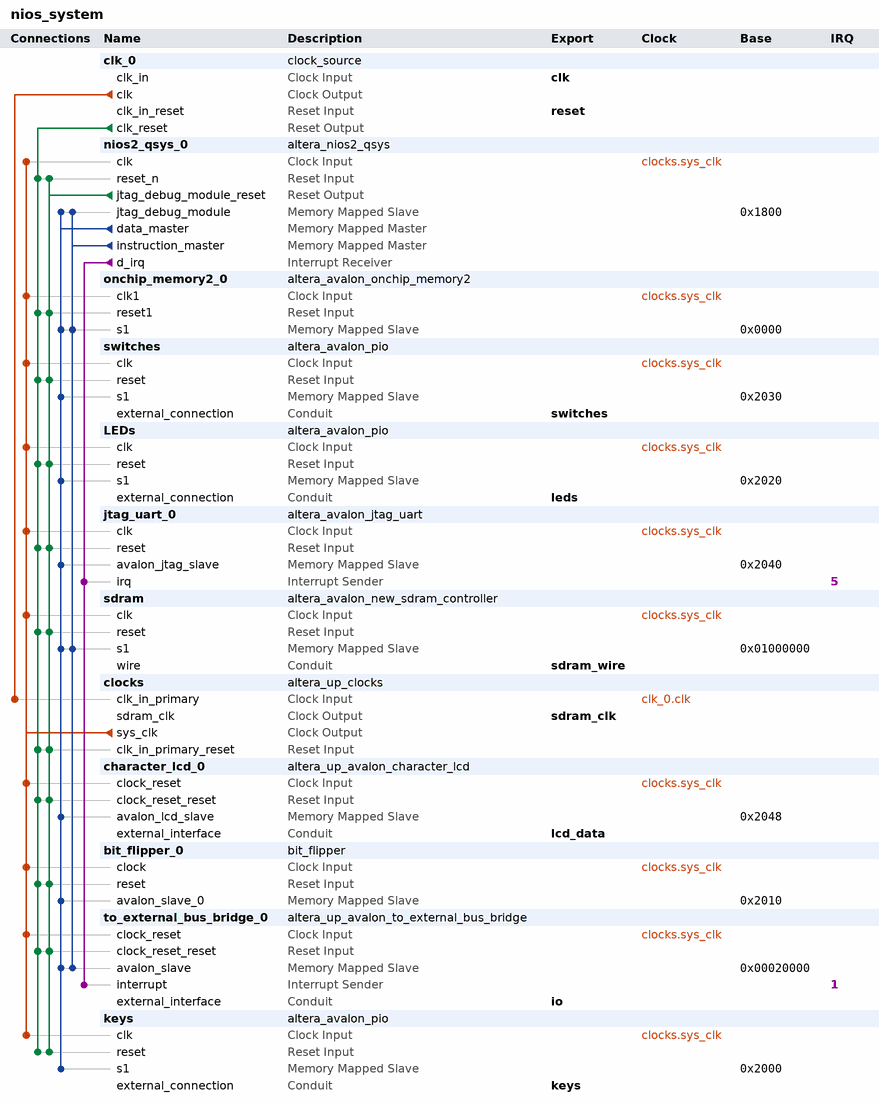
[diagram p0: system contents]
# Platform Designer (Qsys) system nios_system, Cyclone II EP2C35F672C6
# Parameters at their usual value, and those the tool derives, are not listed.
package require -exact qsys 13.0.1.99.2
create_system nios_system
set_project_property DEVICE_FAMILY {Cyclone II}
set_project_property DEVICE EP2C35F672C6

add_instance clk_0 clock_source 13.0
set_instance_parameter_value clk_0 clockFrequency 50000000

add_instance nios2_qsys_0 altera_nios2_qsys 13.0
set_instance_parameter_value nios2_qsys_0 resetSlave sdram.s1
set_instance_parameter_value nios2_qsys_0 mmu_TLBMissExcSlave None
set_instance_parameter_value nios2_qsys_0 exceptionSlave sdram.s1
set_instance_parameter_value nios2_qsys_0 breakSlave nios2_qsys_0.jtag_debug_module
set_instance_parameter_value nios2_qsys_0 impl Tiny
set_instance_parameter_value nios2_qsys_0 icache_size 4096

add_instance onchip_memory2_0 altera_avalon_onchip_memory2 13.0.1.99.2
set_instance_parameter_value onchip_memory2_0 dataWidth 32
set_instance_parameter_value onchip_memory2_0 dualPort false
set_instance_parameter_value onchip_memory2_0 initMemContent true
set_instance_parameter_value onchip_memory2_0 initializationFileName onchip_mem.hex
set_instance_parameter_value onchip_memory2_0 memorySize 4096

add_instance switches altera_avalon_pio 13.0.1.99.2
set_instance_parameter_value switches direction Input
set_instance_parameter_value switches width 8

add_instance LEDs altera_avalon_pio 13.0.1.99.2
set_instance_parameter_value LEDs direction Output
set_instance_parameter_value LEDs width 8

add_instance jtag_uart_0 altera_avalon_jtag_uart 13.0.1.99.2
set_instance_parameter_value jtag_uart_0 simInteractiveOptions NO_INTERACTIVE_WINDOWS

add_instance sdram altera_avalon_new_sdram_controller 13.0.1.99.2
set_instance_parameter_value sdram TAC 5.5
set_instance_parameter_value sdram TRCD 20.0
set_instance_parameter_value sdram TRP 20.0
set_instance_parameter_value sdram casLatency 3
set_instance_parameter_value sdram columnWidth 8
set_instance_parameter_value sdram dataWidth 16
set_instance_parameter_value sdram generateSimulationModel false
set_instance_parameter_value sdram model single_Micron_MT48LC4M32B2_7_chip
set_instance_parameter_value sdram numberOfBanks 4
set_instance_parameter_value sdram numberOfChipSelects 1
set_instance_parameter_value sdram powerUpDelay 100.0
set_instance_parameter_value sdram refreshPeriod 15.625
set_instance_parameter_value sdram rowWidth 12

add_instance clocks altera_up_clocks 13.0
set_instance_parameter_value clocks board DE2
set_instance_parameter_value clocks vga_clk false
set_instance_parameter_value clocks audio_clk false
set_instance_parameter_value clocks audio_clk_freq 12.288

add_instance character_lcd_0 altera_up_avalon_character_lcd 13.0
set_instance_parameter_value character_lcd_0 cursor Normal

add_instance bit_flipper_0 bit_flipper 1.0

add_instance to_external_bus_bridge_0 altera_up_avalon_to_external_bus_bridge 13.0
set_instance_parameter_value to_external_bus_bridge_0 addr_size 64
set_instance_parameter_value to_external_bus_bridge_0 addr_size_multiplier Kbytes
set_instance_parameter_value to_external_bus_bridge_0 data_size 16

add_instance keys altera_avalon_pio 13.0.1.99.2
set_instance_parameter_value keys direction Input
set_instance_parameter_value keys width 4

# connections
add_connection clk_0.clk clocks.clk_in_primary clock
add_connection clocks.sys_clk bit_flipper_0.clock clock
add_connection clocks.sys_clk character_lcd_0.clock_reset clock
add_connection clocks.sys_clk jtag_uart_0.clk clock
add_connection clocks.sys_clk keys.clk clock
add_connection clocks.sys_clk LEDs.clk clock
add_connection clocks.sys_clk nios2_qsys_0.clk clock
add_connection clocks.sys_clk onchip_memory2_0.clk1 clock
add_connection clocks.sys_clk sdram.clk clock
add_connection clocks.sys_clk switches.clk clock
add_connection clocks.sys_clk to_external_bus_bridge_0.clock_reset clock
add_connection clk_0.clk_reset bit_flipper_0.reset reset
add_connection clk_0.clk_reset character_lcd_0.clock_reset_reset reset
add_connection clk_0.clk_reset clocks.clk_in_primary_reset reset
add_connection clk_0.clk_reset jtag_uart_0.reset reset
add_connection clk_0.clk_reset keys.reset reset
add_connection clk_0.clk_reset LEDs.reset reset
add_connection clk_0.clk_reset nios2_qsys_0.reset_n reset
add_connection clk_0.clk_reset onchip_memory2_0.reset1 reset
add_connection clk_0.clk_reset sdram.reset reset
add_connection clk_0.clk_reset switches.reset reset
add_connection clk_0.clk_reset to_external_bus_bridge_0.clock_reset_reset reset
add_connection nios2_qsys_0.jtag_debug_module_reset bit_flipper_0.reset reset
add_connection nios2_qsys_0.jtag_debug_module_reset character_lcd_0.clock_reset_reset reset
add_connection nios2_qsys_0.jtag_debug_module_reset clocks.clk_in_primary_reset reset
add_connection nios2_qsys_0.jtag_debug_module_reset jtag_uart_0.reset reset
add_connection nios2_qsys_0.jtag_debug_module_reset keys.reset reset
add_connection nios2_qsys_0.jtag_debug_module_reset LEDs.reset reset
add_connection nios2_qsys_0.jtag_debug_module_reset nios2_qsys_0.reset_n reset
add_connection nios2_qsys_0.jtag_debug_module_reset onchip_memory2_0.reset1 reset
add_connection nios2_qsys_0.jtag_debug_module_reset sdram.reset reset
add_connection nios2_qsys_0.jtag_debug_module_reset switches.reset reset
add_connection nios2_qsys_0.jtag_debug_module_reset to_external_bus_bridge_0.clock_reset_reset reset
add_connection nios2_qsys_0.data_master bit_flipper_0.avalon_slave_0 avalon
set_connection_parameter_value nios2_qsys_0.data_master/bit_flipper_0.avalon_slave_0 baseAddress 0x2010
add_connection nios2_qsys_0.data_master character_lcd_0.avalon_lcd_slave avalon
set_connection_parameter_value nios2_qsys_0.data_master/character_lcd_0.avalon_lcd_slave baseAddress 0x2048
add_connection nios2_qsys_0.data_master jtag_uart_0.avalon_jtag_slave avalon
set_connection_parameter_value nios2_qsys_0.data_master/jtag_uart_0.avalon_jtag_slave baseAddress 0x2040
add_connection nios2_qsys_0.data_master keys.s1 avalon
set_connection_parameter_value nios2_qsys_0.data_master/keys.s1 baseAddress 0x2000
add_connection nios2_qsys_0.data_master LEDs.s1 avalon
set_connection_parameter_value nios2_qsys_0.data_master/LEDs.s1 baseAddress 0x2020
add_connection nios2_qsys_0.data_master nios2_qsys_0.jtag_debug_module avalon
set_connection_parameter_value nios2_qsys_0.data_master/nios2_qsys_0.jtag_debug_module baseAddress 0x1800
add_connection nios2_qsys_0.data_master onchip_memory2_0.s1 avalon
set_connection_parameter_value nios2_qsys_0.data_master/onchip_memory2_0.s1 baseAddress 0x0000
add_connection nios2_qsys_0.data_master sdram.s1 avalon
set_connection_parameter_value nios2_qsys_0.data_master/sdram.s1 baseAddress 0x01000000
add_connection nios2_qsys_0.data_master switches.s1 avalon
set_connection_parameter_value nios2_qsys_0.data_master/switches.s1 baseAddress 0x2030
add_connection nios2_qsys_0.data_master to_external_bus_bridge_0.avalon_slave avalon
set_connection_parameter_value nios2_qsys_0.data_master/to_external_bus_bridge_0.avalon_slave baseAddress 0x00020000
add_connection nios2_qsys_0.instruction_master nios2_qsys_0.jtag_debug_module avalon
set_connection_parameter_value nios2_qsys_0.instruction_master/nios2_qsys_0.jtag_debug_module baseAddress 0x1800
add_connection nios2_qsys_0.instruction_master onchip_memory2_0.s1 avalon
set_connection_parameter_value nios2_qsys_0.instruction_master/onchip_memory2_0.s1 baseAddress 0x0000
add_connection nios2_qsys_0.instruction_master sdram.s1 avalon
set_connection_parameter_value nios2_qsys_0.instruction_master/sdram.s1 baseAddress 0x01000000
add_connection nios2_qsys_0.instruction_master to_external_bus_bridge_0.avalon_slave avalon
set_connection_parameter_value nios2_qsys_0.instruction_master/to_external_bus_bridge_0.avalon_slave baseAddress 0x00020000
add_connection nios2_qsys_0.d_irq jtag_uart_0.irq interrupt
set_connection_parameter_value nios2_qsys_0.d_irq/jtag_uart_0.irq irqNumber 5
add_connection nios2_qsys_0.d_irq to_external_bus_bridge_0.interrupt interrupt
set_connection_parameter_value nios2_qsys_0.d_irq/to_external_bus_bridge_0.interrupt irqNumber 1

# exported interfaces
add_interface clk clock sink
set_interface_property clk EXPORT_OF clk_0.clk_in
add_interface switches conduit end
set_interface_property switches EXPORT_OF switches.external_connection
add_interface leds conduit end
set_interface_property leds EXPORT_OF LEDs.external_connection
add_interface sdram_wire conduit end
set_interface_property sdram_wire EXPORT_OF sdram.wire
add_interface lcd_data conduit end
set_interface_property lcd_data EXPORT_OF character_lcd_0.external_interface
add_interface sdram_clk clock source
set_interface_property sdram_clk EXPORT_OF clocks.sdram_clk
add_interface io conduit end
set_interface_property io EXPORT_OF to_external_bus_bridge_0.external_interface
add_interface reset reset sink
set_interface_property reset EXPORT_OF clk_0.clk_in_reset
add_interface keys conduit end
set_interface_property keys EXPORT_OF keys.external_connection

set_interconnect_requirement {$system} qsys_mm.clockCrossingAdapter HANDSHAKE
set_interconnect_requirement {$system} qsys_mm.maxAdditionalLatency 1

save_system nios_system.qsys
